# Altium schematic sheet Schematic.SchDoc
size 762 x 330 mm; SheetNumber: 1; SheetTotal: 1
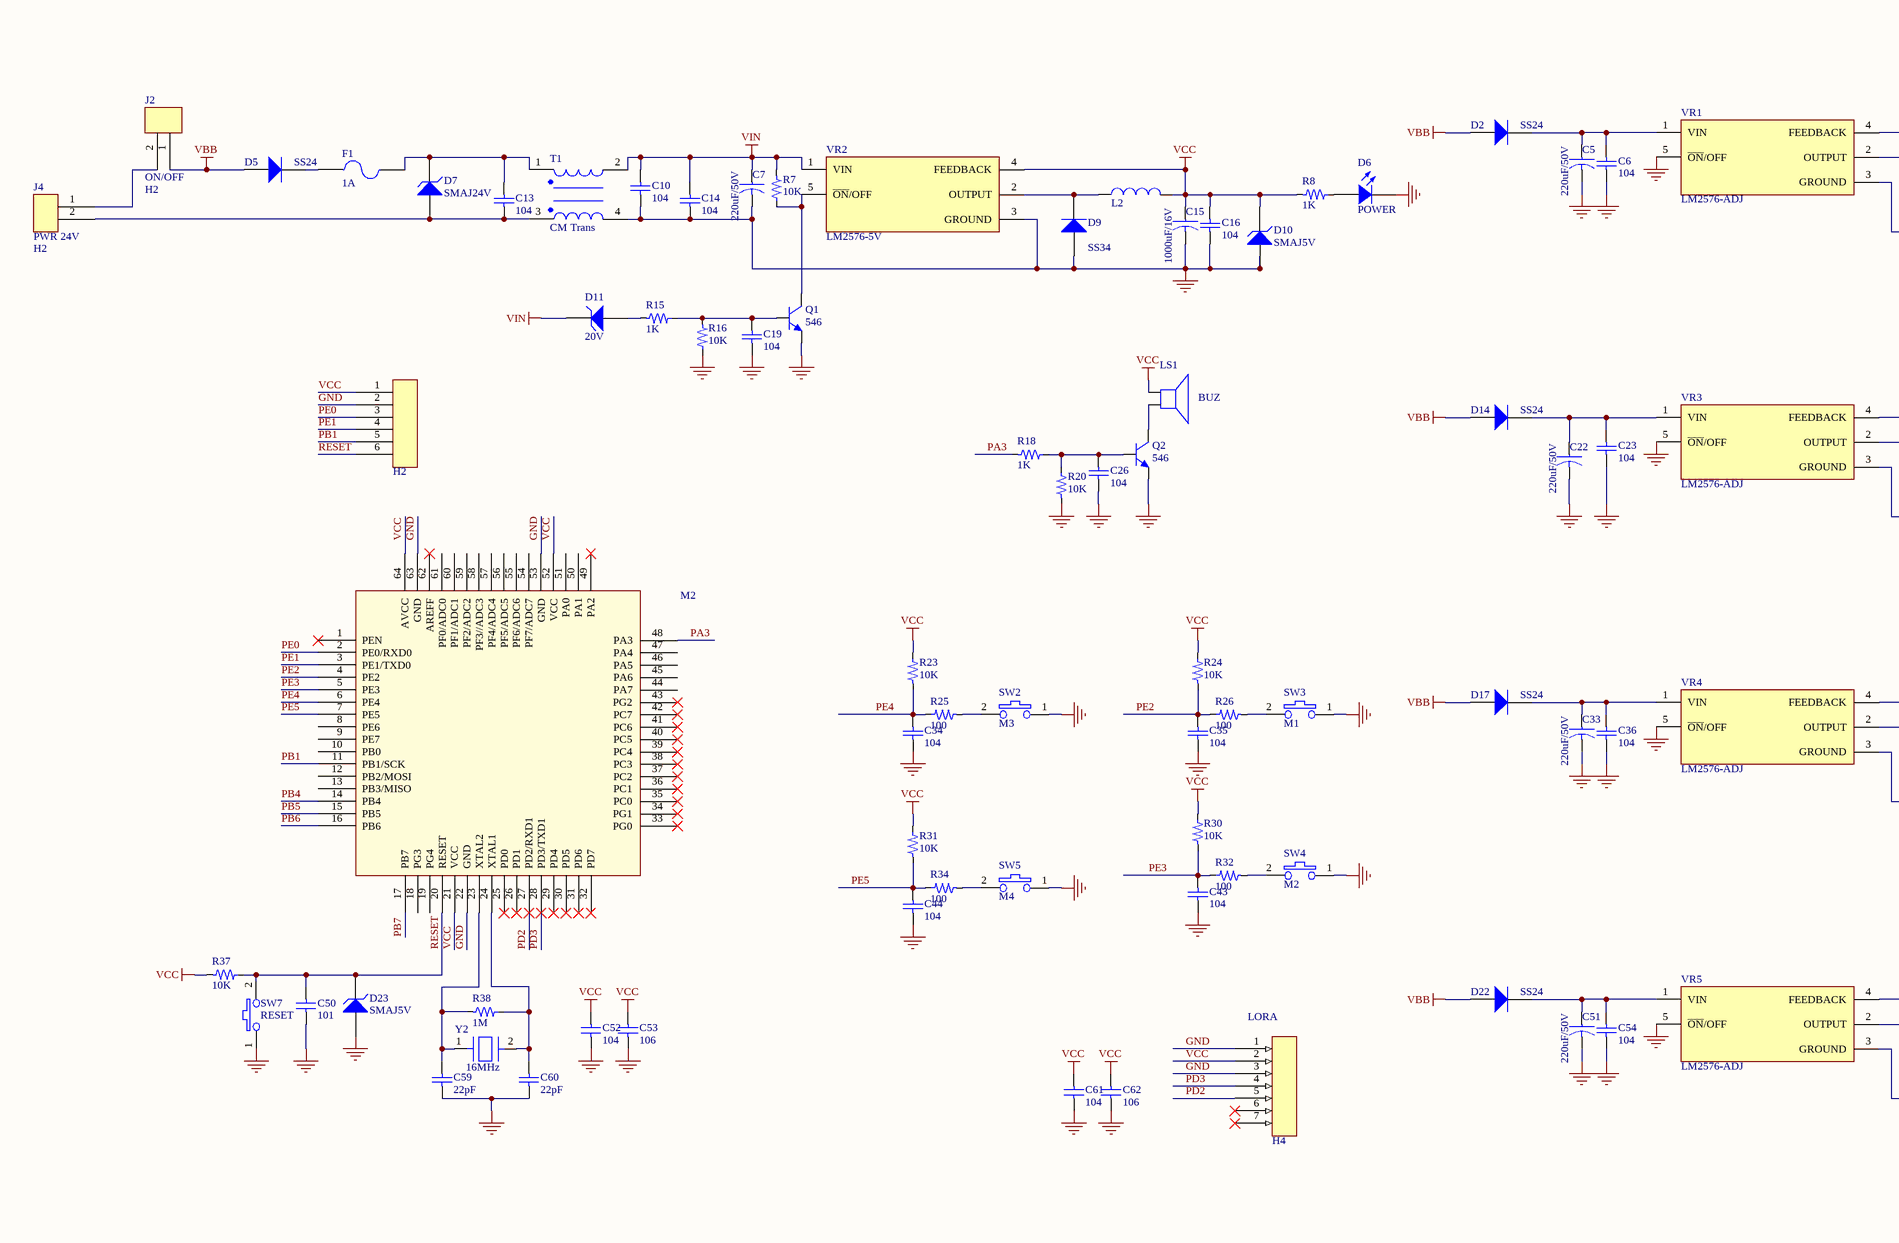
[diagram p0: Schematic.SchDoc, left]
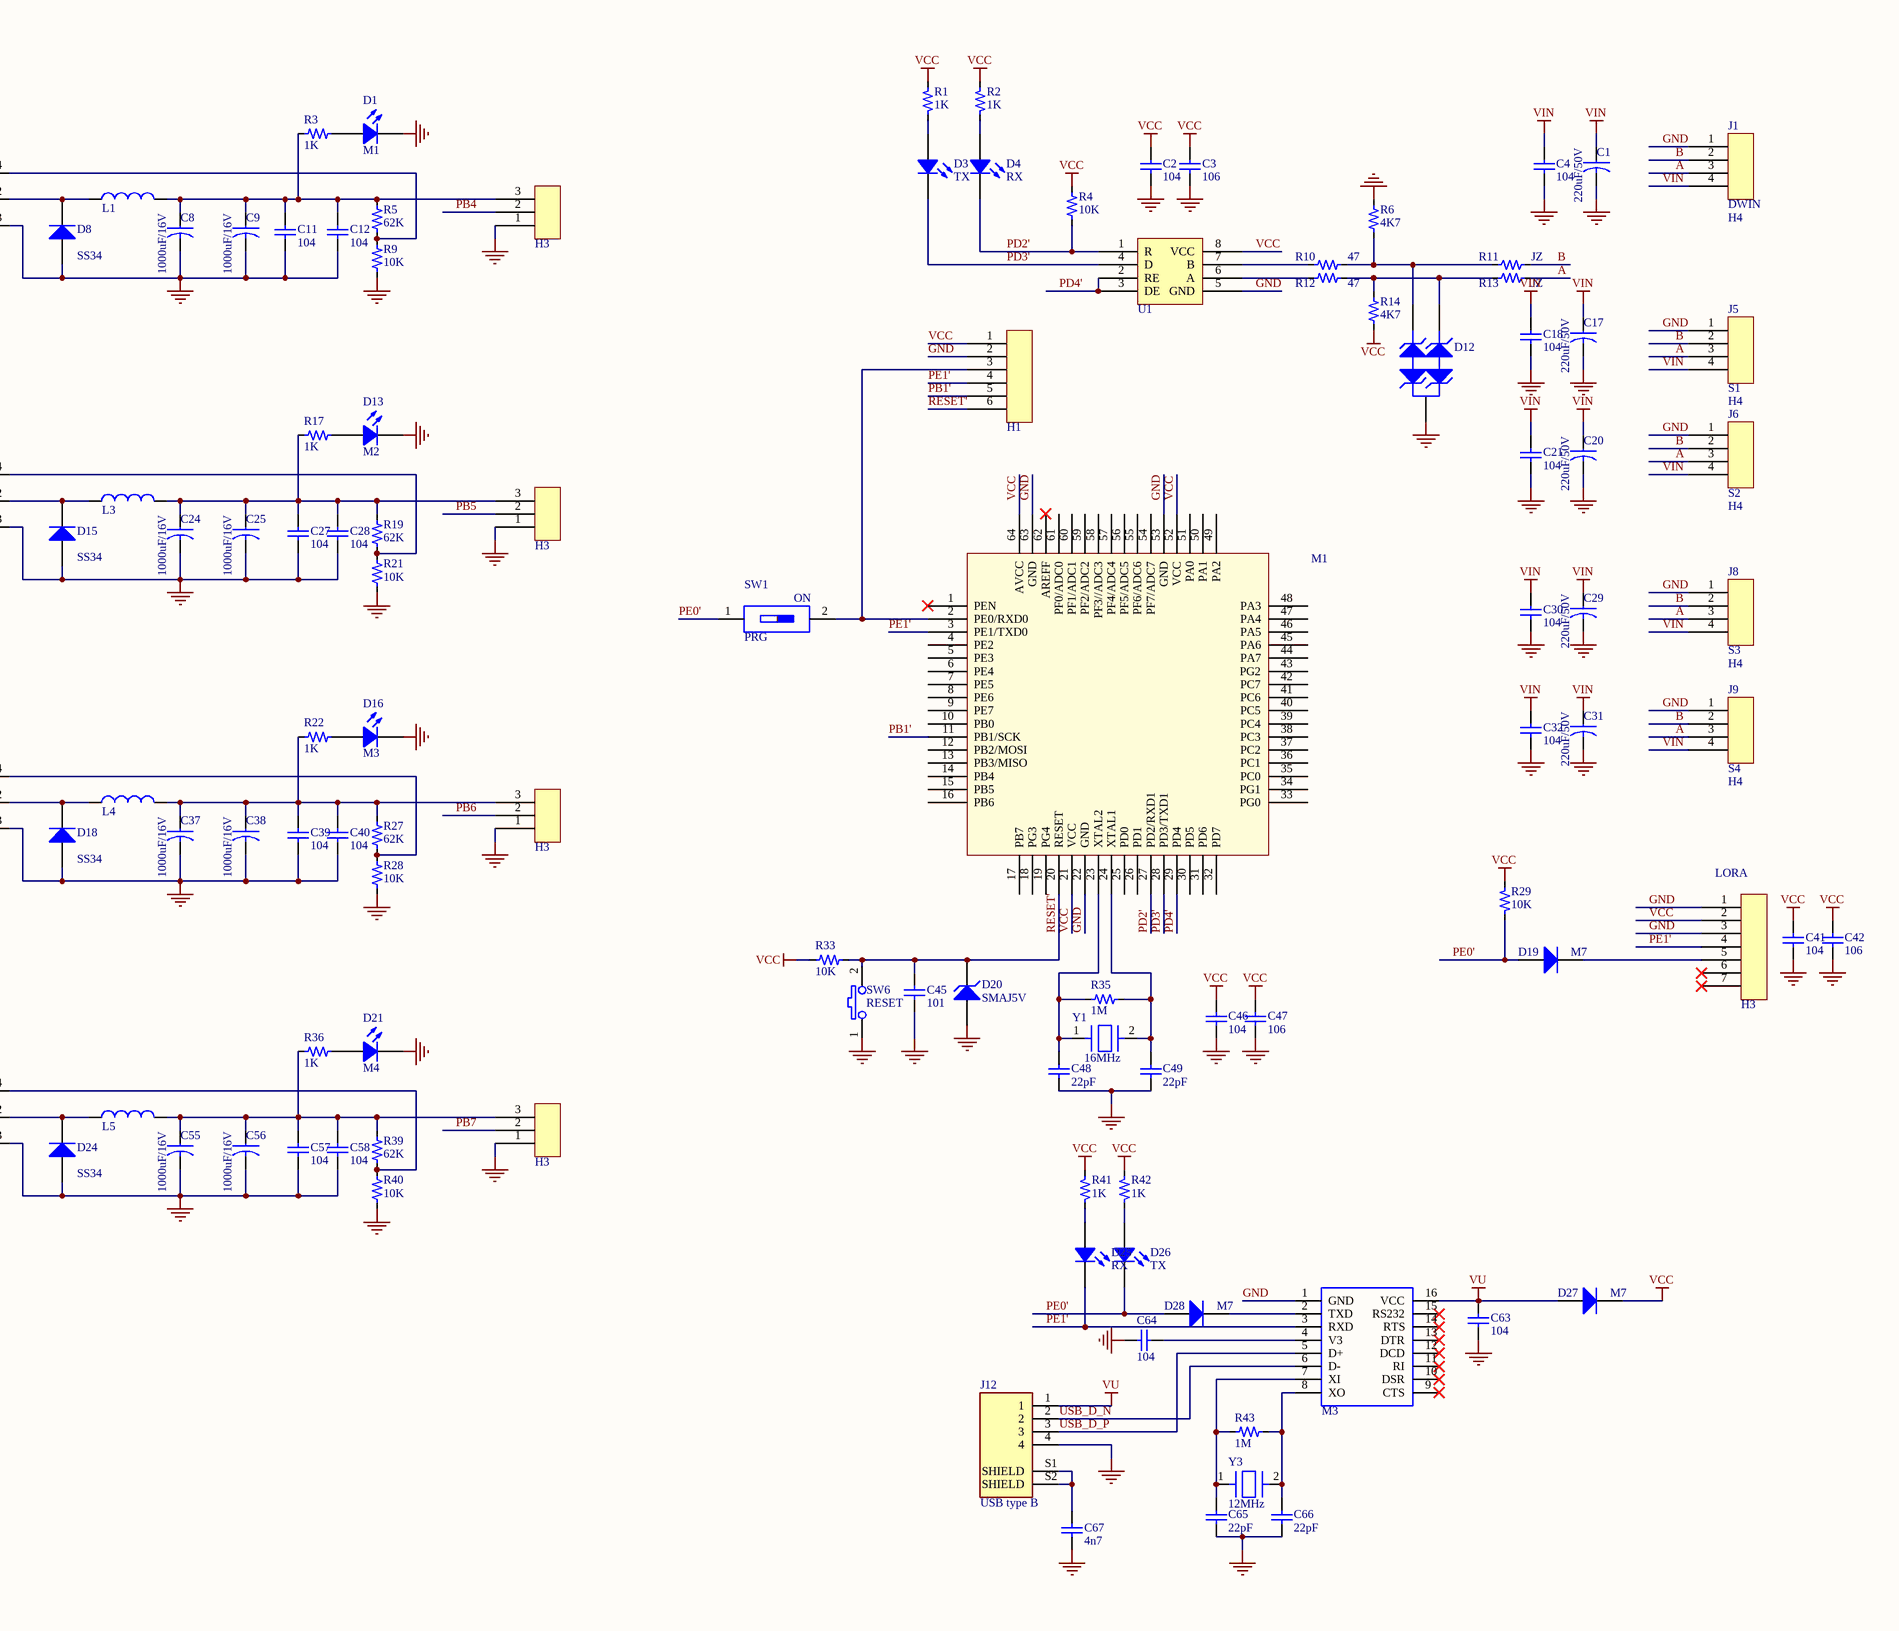
[diagram p1: Schematic.SchDoc, right]

## Parts
C1  value 220uF/50V  [CAP-P-1W]  (hidden comment: CAP POL)
C2  value 104  [C-1206]  (hidden comment: Cap)
C3  value 106  [C-1206]  (hidden comment: Cap)
C4  value 104  [C-1206]  (hidden comment: Cap)
C5  value 220uF/50V  [CAP-P-1W]  (hidden comment: CAP POL)
C6  value 104  [C-1206]  (hidden comment: Cap)
C7  value 220uF/50V  [CAP-P-1W]  (hidden comment: CAP POL)
C8  value 1000uF/16V  [CAP-P-2]  (hidden comment: CAP POL)
C9  value 1000uF/16V  [CAP-P-2]  (hidden comment: CAP POL)
C10  value 104  [CAP-NP-1]  (hidden comment: Cap)
C11  value 104  [C-1206]  (hidden comment: Cap)
C12  value 104  [C-1206]  (hidden comment: Cap)
C13  value 104  [CAP-NP-1]  (hidden comment: Cap)
C14  value 104  [C-1206]  (hidden comment: Cap)
C15  value 1000uF/16V  [CAP-P-2]  (hidden comment: CAP POL)
C16  value 104  [C-1206]  (hidden comment: Cap)
C17  value 220uF/50V  [CAP-P-1W]  (hidden comment: CAP POL)
C18  value 104  [C-1206]  (hidden comment: Cap)
C19  value 104  [C-1206]  (hidden comment: Cap)
C20  value 220uF/50V  [CAP-P-1W]  (hidden comment: CAP POL)
C21  value 104  [C-1206]  (hidden comment: Cap)
C22  value 220uF/50V  [CAP-P-1W]  (hidden comment: CAP POL)
C23  value 104  [C-1206]  (hidden comment: Cap)
C24  value 1000uF/16V  [CAP-P-2]  (hidden comment: CAP POL)
C25  value 1000uF/16V  [CAP-P-2]  (hidden comment: CAP POL)
C26  value 104  [C-1206]  (hidden comment: Cap)
C27  value 104  [C-1206]  (hidden comment: Cap)
C28  value 104  [C-1206]  (hidden comment: Cap)
C29  value 220uF/50V  [CAP-P-1W]  (hidden comment: CAP POL)
C30  value 104  [C-1206]  (hidden comment: Cap)
C31  value 220uF/50V  [CAP-P-1W]  (hidden comment: CAP POL)
C32  value 104  [C-1206]  (hidden comment: Cap)
C33  value 220uF/50V  [CAP-P-1W]  (hidden comment: CAP POL)
C34  value 104  [C-1206]  (hidden comment: Cap)
C35  value 104  [C-1206]  (hidden comment: Cap)
C36  value 104  [C-1206]  (hidden comment: Cap)
C37  value 1000uF/16V  [CAP-P-2]  (hidden comment: CAP POL)
C38  value 1000uF/16V  [CAP-P-2]  (hidden comment: CAP POL)
C39  value 104  [C-1206]  (hidden comment: Cap)
C40  value 104  [C-1206]  (hidden comment: Cap)
C41  value 104  [C-1206]  (hidden comment: Cap)
C42  value 106  [C-1206]  (hidden comment: Cap)
C43  value 104  [C-1206]  (hidden comment: Cap)
C44  value 104  [C-1206]  (hidden comment: Cap)
C45  value 101  [C-1206]  (hidden comment: Cap)
C46  value 104  [C-1206]  (hidden comment: Cap)
C47  value 106  [C-1206]  (hidden comment: Cap)
C48  value 22pF  [C-1206]  (hidden comment: Cap)
C49  value 22pF  [C-1206]  (hidden comment: Cap)
C50  value 101  [C-1206]  (hidden comment: Cap)
C51  value 220uF/50V  [CAP-P-1W]  (hidden comment: CAP POL)
C52  value 104  [C-1206]  (hidden comment: Cap)
C53  value 106  [C-1206]  (hidden comment: Cap)
C54  value 104  [C-1206]  (hidden comment: Cap)
C55  value 1000uF/16V  [CAP-P-2]  (hidden comment: CAP POL)
C56  value 1000uF/16V  [CAP-P-2]  (hidden comment: CAP POL)
C57  value 104  [C-1206]  (hidden comment: Cap)
C58  value 104  [C-1206]  (hidden comment: Cap)
C59  value 22pF  [C-1206]  (hidden comment: Cap)
C60  value 22pF  [C-1206]  (hidden comment: Cap)
C61  value 104  [C-1206]  (hidden comment: Cap)
C62  value 106  [C-1206]  (hidden comment: Cap)
C63  value 104  [C-1206]  (hidden comment: Cap)
C64  value 104  [C-1206]  (hidden comment: Cap)
C65  value 22pF  [C-1206]  (hidden comment: Cap)
C66  value 22pF  [C-1206]  (hidden comment: Cap)
C67  value 4n7  [C-1206]  (hidden comment: Cap)
D1  value M1  [L-1206]  (hidden comment: PWR)
D2  value SS24  [SMB]  (hidden comment: Diode)
D3  TX  [L-1206]
D4  RX  [L-1206]
D5  value SS24  [SMB]  (hidden comment: Diode)
D6  value POWER  [L-1206]  (hidden comment: PWR)
D7  value SMAJ24V  [SMA]  (hidden comment: Zener Diode)
D8  value SS34  [SMA]  (hidden comment: Diode)
D9  value SS34  [SMA]  (hidden comment: Diode)
D10  value SMAJ5V  [SMA]  (hidden comment: Zener Diode)
D11  value 20V  [ZDiode-3]  (hidden comment: Zener Diode)
D12  PSM712  [SOT23]  (value not drawn)
D13  value M2  [L-1206]  (hidden comment: PWR)
D14  value SS24  [SMB]  (hidden comment: Diode)
D15  value SS34  [SMA]  (hidden comment: Diode)
D16  value M3  [L-1206]  (hidden comment: PWR)
D17  value SS24  [SMB]  (hidden comment: Diode)
D18  value SS34  [SMA]  (hidden comment: Diode)
D19  value M7  [SMA]  (hidden comment: Diode)
D20  value SMAJ5V  [SMA]  (hidden comment: Zener Diode)
D21  value M4  [L-1206]  (hidden comment: PWR)
D22  value SS24  [SMB]  (hidden comment: Diode)
D23  value SMAJ5V  [SMA]  (hidden comment: Zener Diode)
D24  value SS34  [SMA]  (hidden comment: Diode)
D25  RX  [L-1206]
D26  TX  [L-1206]
D27  value M7  [SMA]  (hidden comment: Diode)
D28  value M7  [SMA]  (hidden comment: Diode)
F1  value 1A  [FUSE]  (hidden comment: Fuse)
H1  H_1X6  [Header-01X06]  (value not drawn)
H2  H_1X6  [Header-01X06]  (value not drawn)
H3  LORA  [Header-01X07]
H4  LORA  [Header-01X07]
J1  DWIN  value H4  [STD-04-3.55MM]
J2  ON/OFF  value H2  [PLG-02-B]
J3  value H3  [PLG-03-B]  (hidden comment: MOTOR1)
J4  PWR 24V  value H2  [PLG-02-B]
J5  S1  value H4  [STD-04-3.55MM]
J6  S2  value H4  [STD-04-3.55MM]
J7  value H3  [PLG-03-B]  (hidden comment: MOTOR2)
J8  S3  value H4  [STD-04-3.55MM]
J9  S4  value H4  [STD-04-3.55MM]
J10  value H3  [PLG-03-B]  (hidden comment: MOTOR3)
J11  value H3  [PLG-03-B]  (hidden comment: MOTOR4)
J12  USB type B  [USB-Type-B]
L1  Inductor  [L_9X12]  (value not drawn)
L2  Inductor  [L_9X12]  (value not drawn)
L3  Inductor  [L_9X12]  (value not drawn)
L4  Inductor  [L_9X12]  (value not drawn)
L5  Inductor  [L_9X12]  (value not drawn)
LS1  value BUZ  [Buzzer]  (hidden comment: Buzzer)
M1  Atmega128-SMD  [Quad64]  (value not drawn)
M2  Atmega128-SMD  [Quad64]  (value not drawn)
M3  CH340  [SOIC-16]  (value not drawn)
Q1  value 546  [SOT23]  (hidden comment: NPN)
Q2  value 546  [SOT23]  (hidden comment: NPN)
R1  value 1K  [R-1206]  (hidden comment: Resistor)
R2  value 1K  [R-1206]  (hidden comment: Resistor)
R3  value 1K  [R-1206]  (hidden comment: Resistor)
R4  value 10K  [R-1206]  (hidden comment: Resistor)
R5  value 62K  [R-1206]  (hidden comment: Resistor)
R6  value 4K7  [R-1206]  (hidden comment: Resistor)
R7  value 10K  [R-1206]  (hidden comment: Resistor)
R8  value 1K  [R-1206]  (hidden comment: Resistor)
R9  value 10K  [R-1206]  (hidden comment: Resistor)
R10  value 47  [R-1206]  (hidden comment: Resistor)
R11  value JZ  [R-1206]  (hidden comment: Resistor)
R12  value 47  [R-1206]  (hidden comment: Resistor)
R13  value JZ  [R-1206]  (hidden comment: Resistor)
R14  value 4K7  [R-1206]  (hidden comment: Resistor)
R15  value 1K  [R-1206]  (hidden comment: Resistor)
R16  value 10K  [R-1206]  (hidden comment: Resistor)
R17  value 1K  [R-1206]  (hidden comment: Resistor)
R18  value 1K  [R-1206]  (hidden comment: Resistor)
R19  value 62K  [R-1206]  (hidden comment: Resistor)
R20  value 10K  [R-1206]  (hidden comment: Resistor)
R21  value 10K  [R-1206]  (hidden comment: Resistor)
R22  value 1K  [R-1206]  (hidden comment: Resistor)
R23  value 10K  [R-1206]  (hidden comment: Resistor)
R24  value 10K  [R-1206]  (hidden comment: Resistor)
R25  value 100  [R-1206]  (hidden comment: Resistor)
R26  value 100  [R-1206]  (hidden comment: Resistor)
R27  value 62K  [R-1206]  (hidden comment: Resistor)
R28  value 10K  [R-1206]  (hidden comment: Resistor)
R29  value 10K  [R-1206]  (hidden comment: Resistor)
R30  value 10K  [R-1206]  (hidden comment: Resistor)
R31  value 10K  [R-1206]  (hidden comment: Resistor)
R32  value 100  [R-1206]  (hidden comment: Resistor)
R33  value 10K  [R-1206]  (hidden comment: Resistor)
R34  value 100  [R-1206]  (hidden comment: Resistor)
R35  value 1M  [R-1206]  (hidden comment: Resistor)
R36  value 1K  [R-1206]  (hidden comment: Resistor)
R37  value 10K  [R-1206]  (hidden comment: Resistor)
R38  value 1M  [R-1206]  (hidden comment: Resistor)
R39  value 62K  [R-1206]  (hidden comment: Resistor)
R40  value 10K  [R-1206]  (hidden comment: Resistor)
R41  value 1K  [R-1206]  (hidden comment: Resistor)
R42  value 1K  [R-1206]  (hidden comment: Resistor)
R43  value 1M  [R-1206]  (hidden comment: Resistor)
SW1  value PRG  [SW-DIP-01]  (hidden comment: SW-DIP01)
SW2  value M3  [SW-SPST-4-B]  (hidden comment: SET)
SW3  value M1  [SW-SPST-4-B]  (hidden comment: UP)
SW4  value M2  [SW-SPST-4-B]  (hidden comment: DOWN)
SW5  value M4  [SW-SPST-4-B]  (hidden comment: ENTER)
SW6  RESET  [SW-SPST-4]
SW7  RESET  [SW-SPST-4]
T1  CM Trans  [CM_UU9.8]
U1  MAX487  [SOIC_8]  (value not drawn)
VR1  LM2576-ADJ  [TO263_5]
VR2  LM2576-5V  [TO263_5]
VR3  LM2576-ADJ  [TO263_5]
VR4  LM2576-ADJ  [TO263_5]
VR5  LM2576-ADJ  [TO263_5]
Y1  Parameter 1: 16MHz  [Crystal]  (hidden comment: Crystal)
Y2  Parameter 1: 16MHz  [Crystal]  (hidden comment: Crystal)
Y3  Parameter 1: 12MHz  [Crystal]  (hidden comment: Crystal)

## Nets
GND: C1.2 C2.1 C3.1 C4.1 C5.2 C6.1 C7.2 C8.2 C9.2 C10.1 C11.1 C12.1 C14.1 C15.2 C16.1 C17.2 C18.1 C19.1 C20.2 C21.1 C22.2 C23.1 C24.2 C25.2 C26.1 C27.1 C28.1 C29.2 C30.1 C31.2 C32.1 C33.2 C34.1 C35.1 C36.1 C37.2 C38.2 C39.1 C40.1 C41.1 C42.1 C43.1 C44.1 C45.1 C46.1 C47.1 C48.1 C49.1 C50.1 C51.2 C52.1 C53.1 C54.1 C55.2 C56.2 C57.1 C58.1 C59.1 C60.1 C61.1 C62.1 C63.1 C64.1 C65.1 C66.1 C67.1 D1.2(K) D6.2(K) D8.1(A) D9.1(A) D10.1(A) D12.1(A) D13.2(K) D15.1(A) D16.2(K) D18.1(A) D20.1(A) D21.2(K) D23.1(A) D24.1(A) H1.2 H2.2 H3.1 H3.3 H4.1 H4.3 J1.1 J3.1 J5.1 J6.1 J7.1 J8.1 J9.1 J10.1 J11.1 J12.4 M1.22(GND) M1.53(GND) M1.63(GND) M2.22(GND) M2.53(GND) M2.63(GND) M3.1(GND) Q1.3(E) Q2.3(E) R6.2 R9.1 R16.2 R20.1 R21.1 R28.1 R40.1 SW2.1 SW3.1 SW4.1 SW5.1 SW6.1 SW7.1 T1.4 U1.5(GND) VR1.3(GROUND) VR1.5(~{ON}/OFF) VR2.3(GROUND) VR3.3(GROUND) VR3.5(~{ON}/OFF) VR4.3(GROUND) VR4.5(~{ON}/OFF) VR5.3(GROUND) VR5.5(~{ON}/OFF)
VBB: D2.1(A) D5.1(A) D14.1(A) D17.1(A) D22.1(A) J2.1
VCC: C2.2 C3.2 C15.1 C16.2 C41.2 C42.2 C46.2 C47.2 C52.2 C53.2 C61.2 C62.2 D10.2(K) D27.2(K) H1.1 H2.1 H3.2 H4.2 L2.2 LS1.1 M1.21(VCC) M1.52(VCC) M1.64(AVCC) M2.21(VCC) M2.52(VCC) M2.64(AVCC) R1.1 R2.1 R4.2 R8.1 R14.1 R23.2 R24.2 R29.1 R30.2 R31.2 R33.1 R37.1 R41.1 R42.1 U1.8(VCC) VR2.4(FEEDBACK)
VIN: C1.1 C4.2 C7.1 C10.2 C14.2 C17.1 C18.2 C20.1 C21.2 C29.1 C30.2 C31.1 C32.2 D11.2(K) J1.4 J5.4 J6.4 J8.4 J9.4 R7.1 T1.2 VR2.1(VIN)
VU: C63.2 D27.1(A) J12.1 M3.16(VCC)
A: J1.3 J5.3 J6.3 J8.3 J9.3 R13.2
B: J1.2 J5.2 J6.2 J8.2 J9.2 R11.2
PA3: M2.48(PA3) R18.1
PB1: H2.5 M2.11(PB1/SCK)
PB1': H1.5 M1.11(PB1/SCK)
PB4: J3.2 M2.14(PB4)
PB5: J7.2 M2.15(PB5)
PB6: J10.2 M2.16(PB6)
PB7: J11.2 M2.17(PB7)
PD2: H4.5 M2.27(PD2/RXD1)
PD2': D4.2(K) M1.27(PD2/RXD1) R4.1 U1.1(R)
PD3: H4.4 M2.28(PD3/TXD1)
PD3': D3.2(K) M1.28(PD3/TXD1) U1.4(D)
PD4': M1.29(PD4) U1.2(RE) U1.3(DE)
PE0: H2.3 M2.2(PE0/RXD0)
PE0': D19.1(A) D26.2(K) D28.1(A) R29.2 SW1.1
PE1: H2.4 M2.3(PE1/TXD0)
PE1': D25.2(K) H1.4 H3.4 M1.3(PE1/TXD0) M3.3(RXD)
PE2: C35.2 M2.4(PE2) R24.1 R26.2
PE3: C43.2 M2.5(PE3) R30.1 R32.2
PE4: C34.2 M2.6(PE4) R23.1 R25.2
PE5: C44.2 M2.7(PE5) R31.1 R34.2
RESET: C50.2 D23.2(K) H2.6 M2.20(RESET) R37.2 SW7.2
RESET': C45.2 D20.2(K) H1.6 M1.20(RESET) R33.2 SW6.2
USB_D_N: J12.2 M3.6(D-)
USB_D_P: J12.3 M3.5(D+)
NetC5_1: C5.1 C6.2 D2.2(K) VR1.1(VIN)
NetC8_1: C8.1 C9.1 C11.2 C12.2 J3.3 L1.2 R3.1 R5.2
NetC13_1: C13.1 D7.1(A) J4.2 T1.3
NetC13_2: C13.2 D7.2(K) F1.2 T1.1
NetC19_2: C19.2 Q1.2(B) R15.2 R16.1
NetC22_1: C22.1 C23.2 D14.2(K) VR3.1(VIN)
NetC24_1: C24.1 C25.1 C27.2 C28.2 J7.3 L3.2 R17.1 R19.2
NetC26_2: C26.2 Q2.2(B) R18.2 R20.2
NetC33_1: C33.1 C36.2 D17.2(K) VR4.1(VIN)
NetC37_1: C37.1 C38.1 C39.2 C40.2 J10.3 L4.2 R22.1 R27.2
NetC48_2: C48.2 M1.23(XTAL2) R35.1 Y1.1
NetC49_2: C49.2 M1.24(XTAL1) R35.2 Y1.2
NetC51_1: C51.1 C54.2 D22.2(K) VR5.1(VIN)
NetC55_1: C55.1 C56.1 C57.2 C58.2 J11.3 L5.2 R36.1 R39.2
NetC59_2: C59.2 M2.23(XTAL2) R38.1 Y2.1
NetC60_2: C60.2 M2.24(XTAL1) R38.2 Y2.2
NetC64_2: C64.2 M3.4(V3)
NetC65_2: C65.2 M3.7(XI) R43.1 Y3.1
NetC66_2: C66.2 M3.8(XO) R43.2 Y3.2
NetC67_2: C67.2 J12.S1(SHIELD) J12.S2(SHIELD)
NetD1_1: D1.1(A) R3.2
NetD3_1: D3.1(A) R1.2
NetD4_1: D4.1(A) R2.2
NetD5_2: D5.2(K) F1.1
NetD6_1: D6.1(A) R8.2
NetD8_2: D8.2(K) L1.1 VR1.2(OUTPUT)
NetD9_2: D9.2(K) L2.1 VR2.2(OUTPUT)
NetD11_1: D11.1(A) R15.1
NetD12_2: D12.2(K) R6.1 R10.2 R11.1
NetD12_3: D12.3(K) R12.2 R13.1 R14.2
NetD13_1: D13.1(A) R17.2
NetD15_2: D15.2(K) L3.1 VR3.2(OUTPUT)
NetD16_1: D16.1(A) R22.2
NetD18_2: D18.2(K) L4.1 VR4.2(OUTPUT)
NetD19_2: D19.2(K) H3.5
NetD21_1: D21.1(A) R36.2
NetD24_2: D24.2(K) L5.1 VR5.2(OUTPUT)
NetD25_1: D25.1(A) R41.2
NetD26_1: D26.1(A) R42.2
NetD28_2: D28.2(K) M3.2(TXD)
NetH1_3: H1.3 M1.2(PE0/RXD0) SW1.2
NetJ2_2: J2.2 J4.1
NetLS1_2: LS1.2 Q2.1(C)
NetQ1_1: Q1.1(C) R7.2 VR2.5(~{ON}/OFF)
NetR5_1: R5.1 R9.2 VR1.4(FEEDBACK)
NetR10_1: R10.1 U1.7(B)
NetR12_1: R12.1 U1.6(A)
NetR19_1: R19.1 R21.2 VR3.4(FEEDBACK)
NetR25_1: R25.1 SW2.2
NetR26_1: R26.1 SW3.2
NetR27_1: R27.1 R28.2 VR4.4(FEEDBACK)
NetR32_1: R32.1 SW4.2
NetR34_1: R34.1 SW5.2
NetR39_1: R39.1 R40.2 VR5.4(FEEDBACK)

Not connected (* = marked no-connect by the designer): H3 6* 7*; H4 6* 7*; M1 1(PEN)* 4(PE2) 5(PE3) 6(PE4) 7(PE5) 8(PE6) 9(PE7) 10(PB0) 12(PB2/MOSI) 13(PB3/MISO) 14(PB4) 15(PB5) 16(PB6) 17(PB7) 18(PG3) 19(PG4) 25(PD0) 26(PD1) 30(PD5) 31(PD6) 32(PD7) 33(PG0) 34(PG1) 35(PC0) 36(PC1) 37(PC2) 38(PC3) 39(PC4) 40(PC5) 41(PC6) 42(PC7) 43(PG2) 44(PA7) 45(PA6) 46(PA5) 47(PA4) 48(PA3) 49(PA2) 50(PA1) 51(PA0) 54(PF7/ADC7) 55(PF6/ADC6) 56(PF5/ADC5) 57(PF4/ADC4) 58(PF3//ADC3) 59(PF2/ADC2) 60(PF1/ADC1) 61(PF0/ADC0) 62(AREFF)*; M2 1(PEN)* 8(PE6) 9(PE7) 10(PB0) 12(PB2/MOSI) 13(PB3/MISO) 18(PG3) 19(PG4) 25(PD0)* 26(PD1)* 29(PD4)* 30(PD5)* 31(PD6)* 32(PD7)* 33(PG0)* 34(PG1)* 35(PC0)* 36(PC1)* 37(PC2)* 38(PC3)* 39(PC4)* 40(PC5)* 41(PC6)* 42(PC7)* 43(PG2)* 44(PA7) 45(PA6) 46(PA5) 47(PA4) 49(PA2)* 50(PA1) 51(PA0) 54(PF7/ADC7) 55(PF6/ADC6) 56(PF5/ADC5) 57(PF4/ADC4) 58(PF3//ADC3) 59(PF2/ADC2) 60(PF1/ADC1) 61(PF0/ADC0) 62(AREFF)*; M3 9(CTS)* 10(DSR)* 11(RI)* 12(DCD)* 13(DTR)* 14(RTS)* 15(RS232)*

## Notes on the sheet
- (in symbol SW-DIP01) ON

## Library data of the parts
C1 C5 C7-C9 C15 C17 C20 C22 C24 C25 C29 C31 C33 C37 C38 C51 C55 C56 = CAP POL: MP: EEE-FK1H221GP; MF: Panasonic Electronic; SnapEDA_Link: https://www.snapeda.com/parts/EEE-FK1H221GP/Panasonic%20Electronic%20Components/view-part/1428461/?ref=snap; Package: RADIAL-2 Panasonic; Purchase-URL: https://pricing.snapeda.com/search/part/EEE-FK1H221GP/?ref=eda; Availability: In Stock; Price: None; Check_prices: https://www.snapeda.com/parts/EEE-FK1H221GP/Panasonic%20Electronic%20Components/view-part/1428461/?ref=eda
C2-C4 C6 C10-C14 C16 C18 C19 C21 C23 C26-C28 C30 C32 C34-C36 C39-C50 C52-C54 C57-C67 = Cap: Capacitor; Published: 8-Jun-2000; LatestRevisionDate: 17-Jul-2002; LatestRevisionNote: Re-released for DXP Platform.; PackageReference: RAD-0.3; Publisher: Altium Limited; PackageDescription: Radial Cap, Thru-Hole; 2 Leads; 0.3 in Pin Spacing; Parameter 1: *
D1 D3 D4 D6 D13 D16 D21 D25 D26 = LED: Typical INFRARED GaAs LED; Published: 8-Jun-2000; LatestRevisionDate: 08-Jul-2005; LatestRevisionNote: Mech Layer 1 removed.; PackageReference: LED-0; Publisher: Altium Limited; PackageDescription: LED; 2 Leads
  D3 D26: Value: TX
  D4 D25: Value: RX
D2 D5 D8 D9 D14 D15 D17-D19 D22 D24 D27 D28 = Diode: Default Diode; Published: 8-Jun-2000; LatestRevisionDate: 17-Jul-2002; LatestRevisionNote: Re-released for DXP Platform.; PackageVersion: Sep-1996; PackageReference: SMC; Publisher: Altium Limited; PackageDescription: DO-214-AB/SMC; 2 C-Bend Leads; Body 7.9 x 5.9 mm, inc. leads (LxW); Code_JEDEC: DO-214-AB
D7 D10 D11 D20 D23 = Zener Diode: MP: SMBJ24CA; MF: Taiwan Semiconductor; Availability: In Stock; SnapEDA_Link: https://www.snapeda.com/parts/SMBJ24CA/Taiwan+Semiconductor/view-part/?ref=snap; Check_prices: https://www.snapeda.com/parts/SMBJ24CA/Taiwan+Semiconductor/view-part/?ref=eda; Price: None; Purchase-URL: https://pricing.snapeda.com/search/part/SMBJ24CA/?ref=eda; Package: SMB Taiwan Semiconductor
H3 H4 = H_1X7
J1 J5 J6 J8 J9 = CON04
J2 J4 = CON02
J3 J7 J10 J11 = CON03
J12 = USB type B: USB-B (USB TYPE-B) USB 2.0 Receptacle Connector 4 Position Through Hole, Right Angle; MF: Wurth Elektronik; MP: 61400416121; SnapEDA_Link: https://www.snapeda.com/parts/61400416121/Wurth+Elektronik/view-part/?ref=snap; Package: None; Value: *; Check_prices: https://www.snapeda.com/parts/61400416121/Wurth+Elektronik/view-part/?ref=eda
LS1 = Buzzer: Buzzers Indicator, Internally Driven Electromechanical/Magnetic 3V 30mA 2.7kHz 80dB @ 3V, 10cm Through Hole PC Pins; MF: PUI Audio, Inc.; MP: AI-1027-TWT-3V-R; Price: None; SnapEDA_Link: https://www.snapeda.com/parts/AI-1027-TWT-3V-R/PUI%20Audio,%20Inc./view-part/7376009/?ref=snap; Purchase-URL: https://pricing.snapeda.com/search/part/AI-1027-TWT-3V-R/?ref=eda; Check_prices: https://www.snapeda.com/parts/AI-1027-TWT-3V-R/PUI%20Audio,%20Inc./view-part/7376009/?ref=eda; Package: None; Availability: In Stock
Q1 Q2 = NPN-CBE: NPN Bipolar Transistor; Published: 8-Jun-2000; LatestRevisionDate: 17-Jul-2002; LatestRevisionNote: Re-released for DXP Platform.; PackageReference: TO-226-AA; Publisher: Altium Limited; PackageDescription: TO, Flat Index; 3 In-Line, Axial Leads; Body Dia. 4.8mm; Leads 0.55 x 0.51 mm (max); Code_JEDEC: TO-226-AA
SW2-SW7 = PushButton: Switch Push Button OFF (ON) SPST Round Button 0.05A 24VDC Momentary Contact PC Pins Thru-Hole; MF: TE Connectivity; MP: 3-1825910-1; SnapEDA_Link: https://www.snapeda.com/parts/3-1825910-1/TE+Connectivity+ALCOSWITCH+Switches/view-part/?ref=snap; Purchase-URL: https://pricing.snapeda.com/search/part/3-1825910-1/?ref=eda; Availability: In Stock; Price: None; Package: None; Check_prices: https://www.snapeda.com/parts/3-1825910-1/TE+Connectivity+ALCOSWITCH+Switches/view-part/?ref=eda
  SW6 SW7: Value: RESET
T1 = CM Trans: 2 Line Common Mode Choke; MF: Murata; MP: DLP11SN900HL2L; Purchase-URL: https://pricing.snapeda.com/search/part/DLP11SN900HL2L/?ref=eda; Package: 1210 Murata; Value: *; Check_prices: https://www.snapeda.com/parts/DLP11SN900HL2L/Murata/view-part/?ref=eda; SnapEDA_Link: https://www.snapeda.com/parts/DLP11SN900HL2L/Murata/view-part/?ref=snap; Availability: In Stock; Price: None
VR1-VR5 = LM2576HVT-ADJ: SIMPLE SWITCHER&reg; 4V to 60V, 3A Low Component Count Step-Down Regulator 5-TO-220 -40 to 125; MF: Texas Instruments; SnapEDA_Link: https://www.snapeda.com/parts/LM2576HVT-ADJ/Texas+Instruments/view-part/?ref=snap; Package: TO-220-5 Texas Instruments; MP: LM2576HVT-ADJ; Check_prices: https://www.snapeda.com/parts/LM2576HVT-ADJ/Texas+Instruments/view-part/?ref=eda; Purchase-URL: https://pricing.snapeda.com/search/part/LM2576HVT-ADJ/?ref=eda; Price: None; Value: *; Availability: In Stock
F1 = Fuse: Published: 8-Jun-2000; LatestRevisionDate: 17-Jul-2002; LatestRevisionNote: Re-released for DXP Platform.; PackageReference: PIN-W2/E2.8; Publisher: Altium Limited; PackageDescription: Thru-Hole; 2 Leads
L1-L5 = Inductor: Published: 8-Jun-2000; LatestRevisionDate: 08-Jul-2005; LatestRevisionNote: Mech Layer 1 removed.; PackageReference: LED-0; Publisher: Altium Limited; PackageDescription: LED; 2 Leads
R1-R43 = Resistor: Published: 8-Jun-2000; LatestRevisionDate: 17-Jul-2002; LatestRevisionNote: Re-released for DXP Platform.; PackageReference: AXIAL-0.3; Publisher: Altium Limited; PackageDescription: Axial Device, Thru-Hole; 2 Leads; 0.3 in Pin Spacing